# Altium schematic sheet connectors.SchDoc: foxBMS BMS-Slave 12-Cell
size A3; DocumentNumber: 16; SheetNumber: 16; SheetTotal: 19; AUTHOR: Fraunhofer IISB foxBMS Team; SheetDescription: Connectors
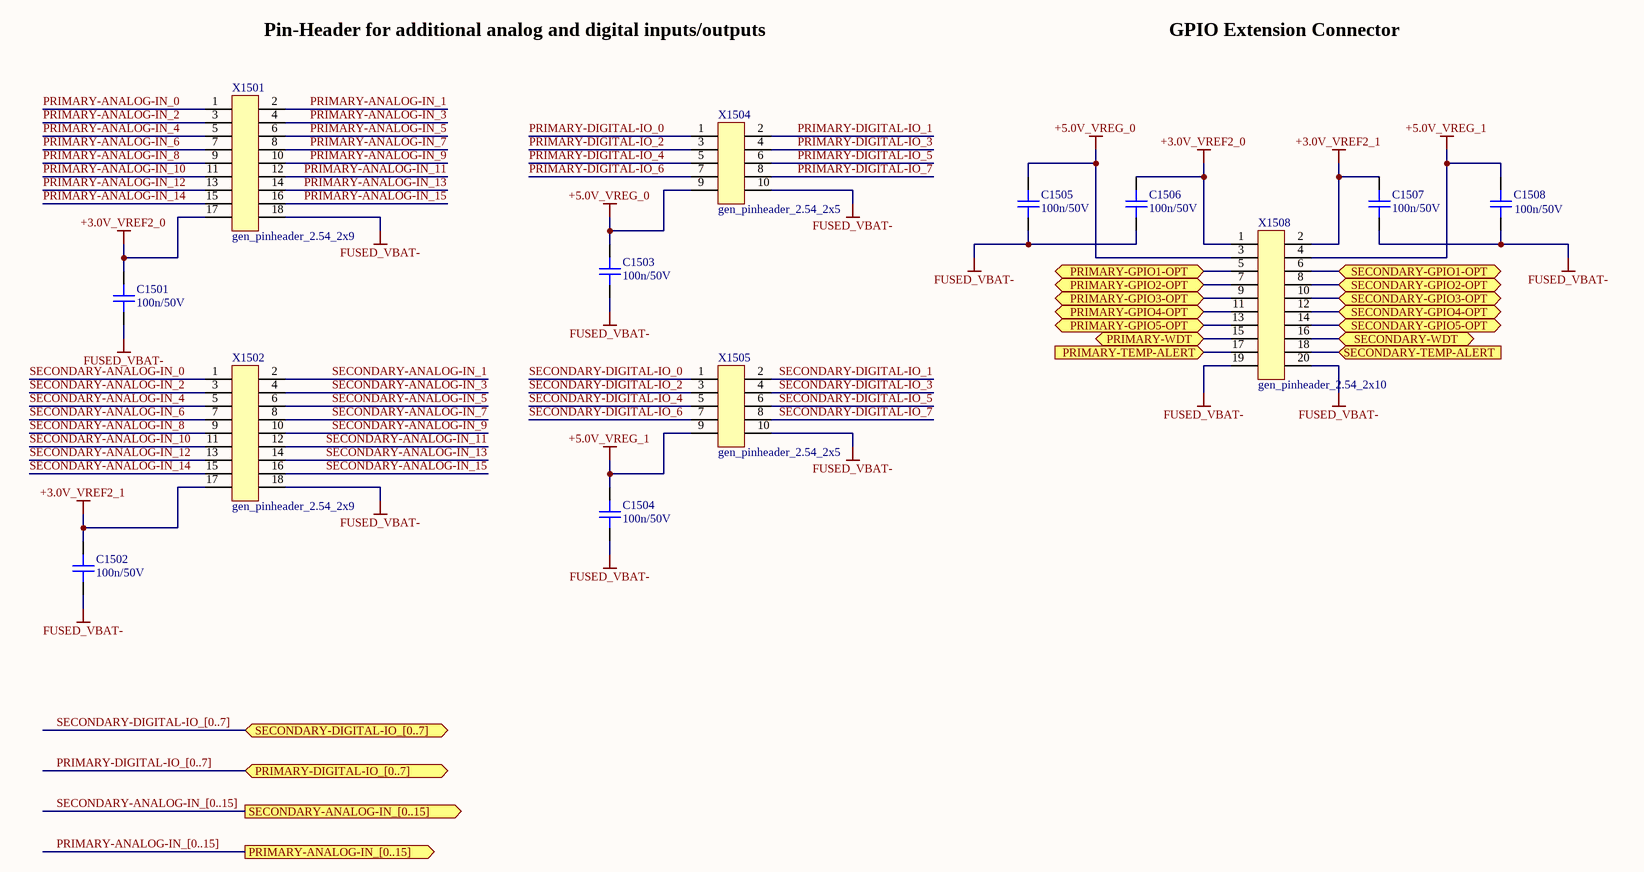
[diagram p0: connectors.SchDoc]

## Parts
C1501  100n/50V  [CAPC1608X08N]
C1502  100n/50V  [CAPC1608X08N]
C1503  100n/50V  [CAPC1608X08N]
C1504  100n/50V  [CAPC1608X08N]
C1505  100n/50V  [CAPC1608X08N]
C1506  100n/50V  [CAPC1608X08N]
C1507  100n/50V  [CAPC1608X08N]
C1508  100n/50V  [CAPC1608X08N]
X1501  gen_pinheader_2.54_2x9  [Pinheader_2.54_2x9]
X1502  gen_pinheader_2.54_2x9  [Pinheader_2.54_2x9]
X1504  gen_pinheader_2.54_2x5  [Pinheader_2.54_2x5]
X1505  gen_pinheader_2.54_2x5  [Pinheader_2.54_2x5]
X1508  gen_pinheader_2.54_2x10  [Pinheader_2.54_2x10]

## Ports
PRIMARY-ANALOG-IN_[0..15] (out), PRIMARY-DIGITAL-IO_[0..7] (bidir), PRIMARY-GPIO1-OPT (bidir), PRIMARY-GPIO2-OPT (bidir), PRIMARY-GPIO3-OPT (bidir), PRIMARY-GPIO4-OPT (bidir), PRIMARY-GPIO5-OPT (bidir), PRIMARY-TEMP-ALERT (in), PRIMARY-WDT (bidir), SECONDARY-ANALOG-IN_[0..15] (out), SECONDARY-DIGITAL-IO_[0..7] (bidir), SECONDARY-GPIO1-OPT (bidir), SECONDARY-GPIO2-OPT (bidir), SECONDARY-GPIO3-OPT (bidir), SECONDARY-GPIO4-OPT (bidir), SECONDARY-GPIO5-OPT (bidir), SECONDARY-TEMP-ALERT (in), SECONDARY-WDT (bidir)

## Nets
+3.0V_VREF2_0: C1501.2 C1506.2 X1501.17 X1508.1
+3.0V_VREF2_1: C1502.2 C1507.2 X1502.17 X1508.2
+5.0V_VREG_0: C1503.2 C1505.2 X1504.9 X1508.3
+5.0V_VREG_1: C1504.2 C1508.2 X1505.9 X1508.4
FUSED_VBAT-: C1501.1 C1502.1 C1503.1 C1504.1 C1505.1 C1506.1 C1507.1 C1508.1 X1501.18 X1502.18 X1504.10 X1505.10 X1508.19 X1508.20
PRIMARY-ANALOG-IN_0: X1501.1
PRIMARY-ANALOG-IN_1: X1501.2
PRIMARY-ANALOG-IN_2: X1501.3
PRIMARY-ANALOG-IN_3: X1501.4
PRIMARY-ANALOG-IN_4: X1501.5
PRIMARY-ANALOG-IN_5: X1501.6
PRIMARY-ANALOG-IN_6: X1501.7
PRIMARY-ANALOG-IN_7: X1501.8
PRIMARY-ANALOG-IN_8: X1501.9
PRIMARY-ANALOG-IN_9: X1501.10
PRIMARY-ANALOG-IN_10: X1501.11
PRIMARY-ANALOG-IN_11: X1501.12
PRIMARY-ANALOG-IN_12: X1501.13
PRIMARY-ANALOG-IN_13: X1501.14
PRIMARY-ANALOG-IN_14: X1501.15
PRIMARY-ANALOG-IN_15: X1501.16
PRIMARY-DIGITAL-IO_0: X1504.1
PRIMARY-DIGITAL-IO_1: X1504.2
PRIMARY-DIGITAL-IO_2: X1504.3
PRIMARY-DIGITAL-IO_3: X1504.4
PRIMARY-DIGITAL-IO_4: X1504.5
PRIMARY-DIGITAL-IO_5: X1504.6
PRIMARY-DIGITAL-IO_6: X1504.7
PRIMARY-DIGITAL-IO_7: X1504.8
PRIMARY-GPIO1-OPT: X1508.5 ; port PRIMARY-GPIO1-OPT
PRIMARY-GPIO2-OPT: X1508.7 ; port PRIMARY-GPIO2-OPT
PRIMARY-GPIO3-OPT: X1508.9 ; port PRIMARY-GPIO3-OPT
PRIMARY-GPIO4-OPT: X1508.11 ; port PRIMARY-GPIO4-OPT
PRIMARY-GPIO5-OPT: X1508.13 ; port PRIMARY-GPIO5-OPT
PRIMARY-TEMP-ALERT: X1508.17 ; port PRIMARY-TEMP-ALERT
PRIMARY-WDT: X1508.15 ; port PRIMARY-WDT
SECONDARY-ANALOG-IN_0: X1502.1
SECONDARY-ANALOG-IN_1: X1502.2
SECONDARY-ANALOG-IN_2: X1502.3
SECONDARY-ANALOG-IN_3: X1502.4
SECONDARY-ANALOG-IN_4: X1502.5
SECONDARY-ANALOG-IN_5: X1502.6
SECONDARY-ANALOG-IN_6: X1502.7
SECONDARY-ANALOG-IN_7: X1502.8
SECONDARY-ANALOG-IN_8: X1502.9
SECONDARY-ANALOG-IN_9: X1502.10
SECONDARY-ANALOG-IN_10: X1502.11
SECONDARY-ANALOG-IN_11: X1502.12
SECONDARY-ANALOG-IN_12: X1502.13
SECONDARY-ANALOG-IN_13: X1502.14
SECONDARY-ANALOG-IN_14: X1502.15
SECONDARY-ANALOG-IN_15: X1502.16
SECONDARY-DIGITAL-IO_0: X1505.1
SECONDARY-DIGITAL-IO_1: X1505.2
SECONDARY-DIGITAL-IO_2: X1505.3
SECONDARY-DIGITAL-IO_3: X1505.4
SECONDARY-DIGITAL-IO_4: X1505.5
SECONDARY-DIGITAL-IO_5: X1505.6
SECONDARY-DIGITAL-IO_6: X1505.7
SECONDARY-DIGITAL-IO_7: X1505.8
SECONDARY-GPIO1-OPT: X1508.6 ; port SECONDARY-GPIO1-OPT
SECONDARY-GPIO2-OPT: X1508.8 ; port SECONDARY-GPIO2-OPT
SECONDARY-GPIO3-OPT: X1508.10 ; port SECONDARY-GPIO3-OPT
SECONDARY-GPIO4-OPT: X1508.12 ; port SECONDARY-GPIO4-OPT
SECONDARY-GPIO5-OPT: X1508.14 ; port SECONDARY-GPIO5-OPT
SECONDARY-TEMP-ALERT: X1508.18 ; port SECONDARY-TEMP-ALERT
SECONDARY-WDT: X1508.16 ; port SECONDARY-WDT

## Buses and harness runs
bus PRIMARY-ANALOG-IN_[0..15] = port PRIMARY-ANALOG-IN_[0..15]
bus PRIMARY-DIGITAL-IO_[0..7] = port PRIMARY-DIGITAL-IO_[0..7]
bus SECONDARY-ANALOG-IN_[0..15] = port SECONDARY-ANALOG-IN_[0..15]
bus SECONDARY-DIGITAL-IO_[0..7] = port SECONDARY-DIGITAL-IO_[0..7]

## Notes on the sheet
- Pin-Header for additional analog and digital inputs/outputs
- GPIO Extension Connector
- Fraunhofer IISB
- Schottkystr. 10
- developed by:
- 91058 Erlangen
- Germany
- Author
- Project
- License
- Description
- File
- Version
- Release Date
- Sheet
- www.foxbms.org
- www.iisb.fraunhofer.de
- foxBMS Team
- /

## Library data of the parts
C1501-C1508 = gen_C_ceramic_100n_50V_X7R_0603: MLCC; Capacitance: 100n; Rated Voltage: 50V; Dielectric: X7R; Case EIA: 0603; Case Metric: 1608; PnP Package: C_0603_10; PnP Value: 100n/50V/X7R; PnP equipped: x; Automotive Qualified: False; Part Number: gen_C_ceramic_100n_50V_X7R_0603; Supplier 1: Farnell; Supplier Part Number 1: 2525267; Supplier 2: Digikey; Supplier Part Number 2: 490-6049-1-ND
X1501 X1502 = gen_pinheader_2.54_2x9: Standard Pinheader, THD, gerade, 2.54mm, 2-reihig; Circuits: 18; Rated Voltage: 250V; Rated Current: 3A; Automotive Qualified: False; Part Number: gen_pinheader_2.54_2x9; Part Name: PinHeader; Operating Temperature: −40 °C - +105 °C; Supplier 1: Farnell; Supplier Part Number 1: 2025256
X1504 X1505 = gen_pinheader_2.54_2x5: Standard Pinheader, THD, gerade, 2.54mm, 2-reihig; Circuits: 10; Rated Voltage: 250V; Rated Current: 3A; Automotive Qualified: False; Part Number: gen_pinheader_2.54_2x5; Part Name: PinHeader; Operating Temperature: −40 °C - +105 °C; Supplier 1: Farnell; Supplier Part Number 1: 2578720
X1508 = gen_pinheader_2.54_2x10: Standard Pinheader, THD, gerade, 2.54mm, 2-reihig; Circuits: 20; Rated Voltage: 250V; Rated Current: 3A; Automotive Qualified: False; Part Number: gen_pinheader_2.54_2x10; Part Name: PinHeader; Operating Temperature: −40 °C - +105 °C; Supplier 1: Farnell; Supplier Part Number 1: 2025257